# EasyEDA Pro project design.epro, board testing_stage1_pcb
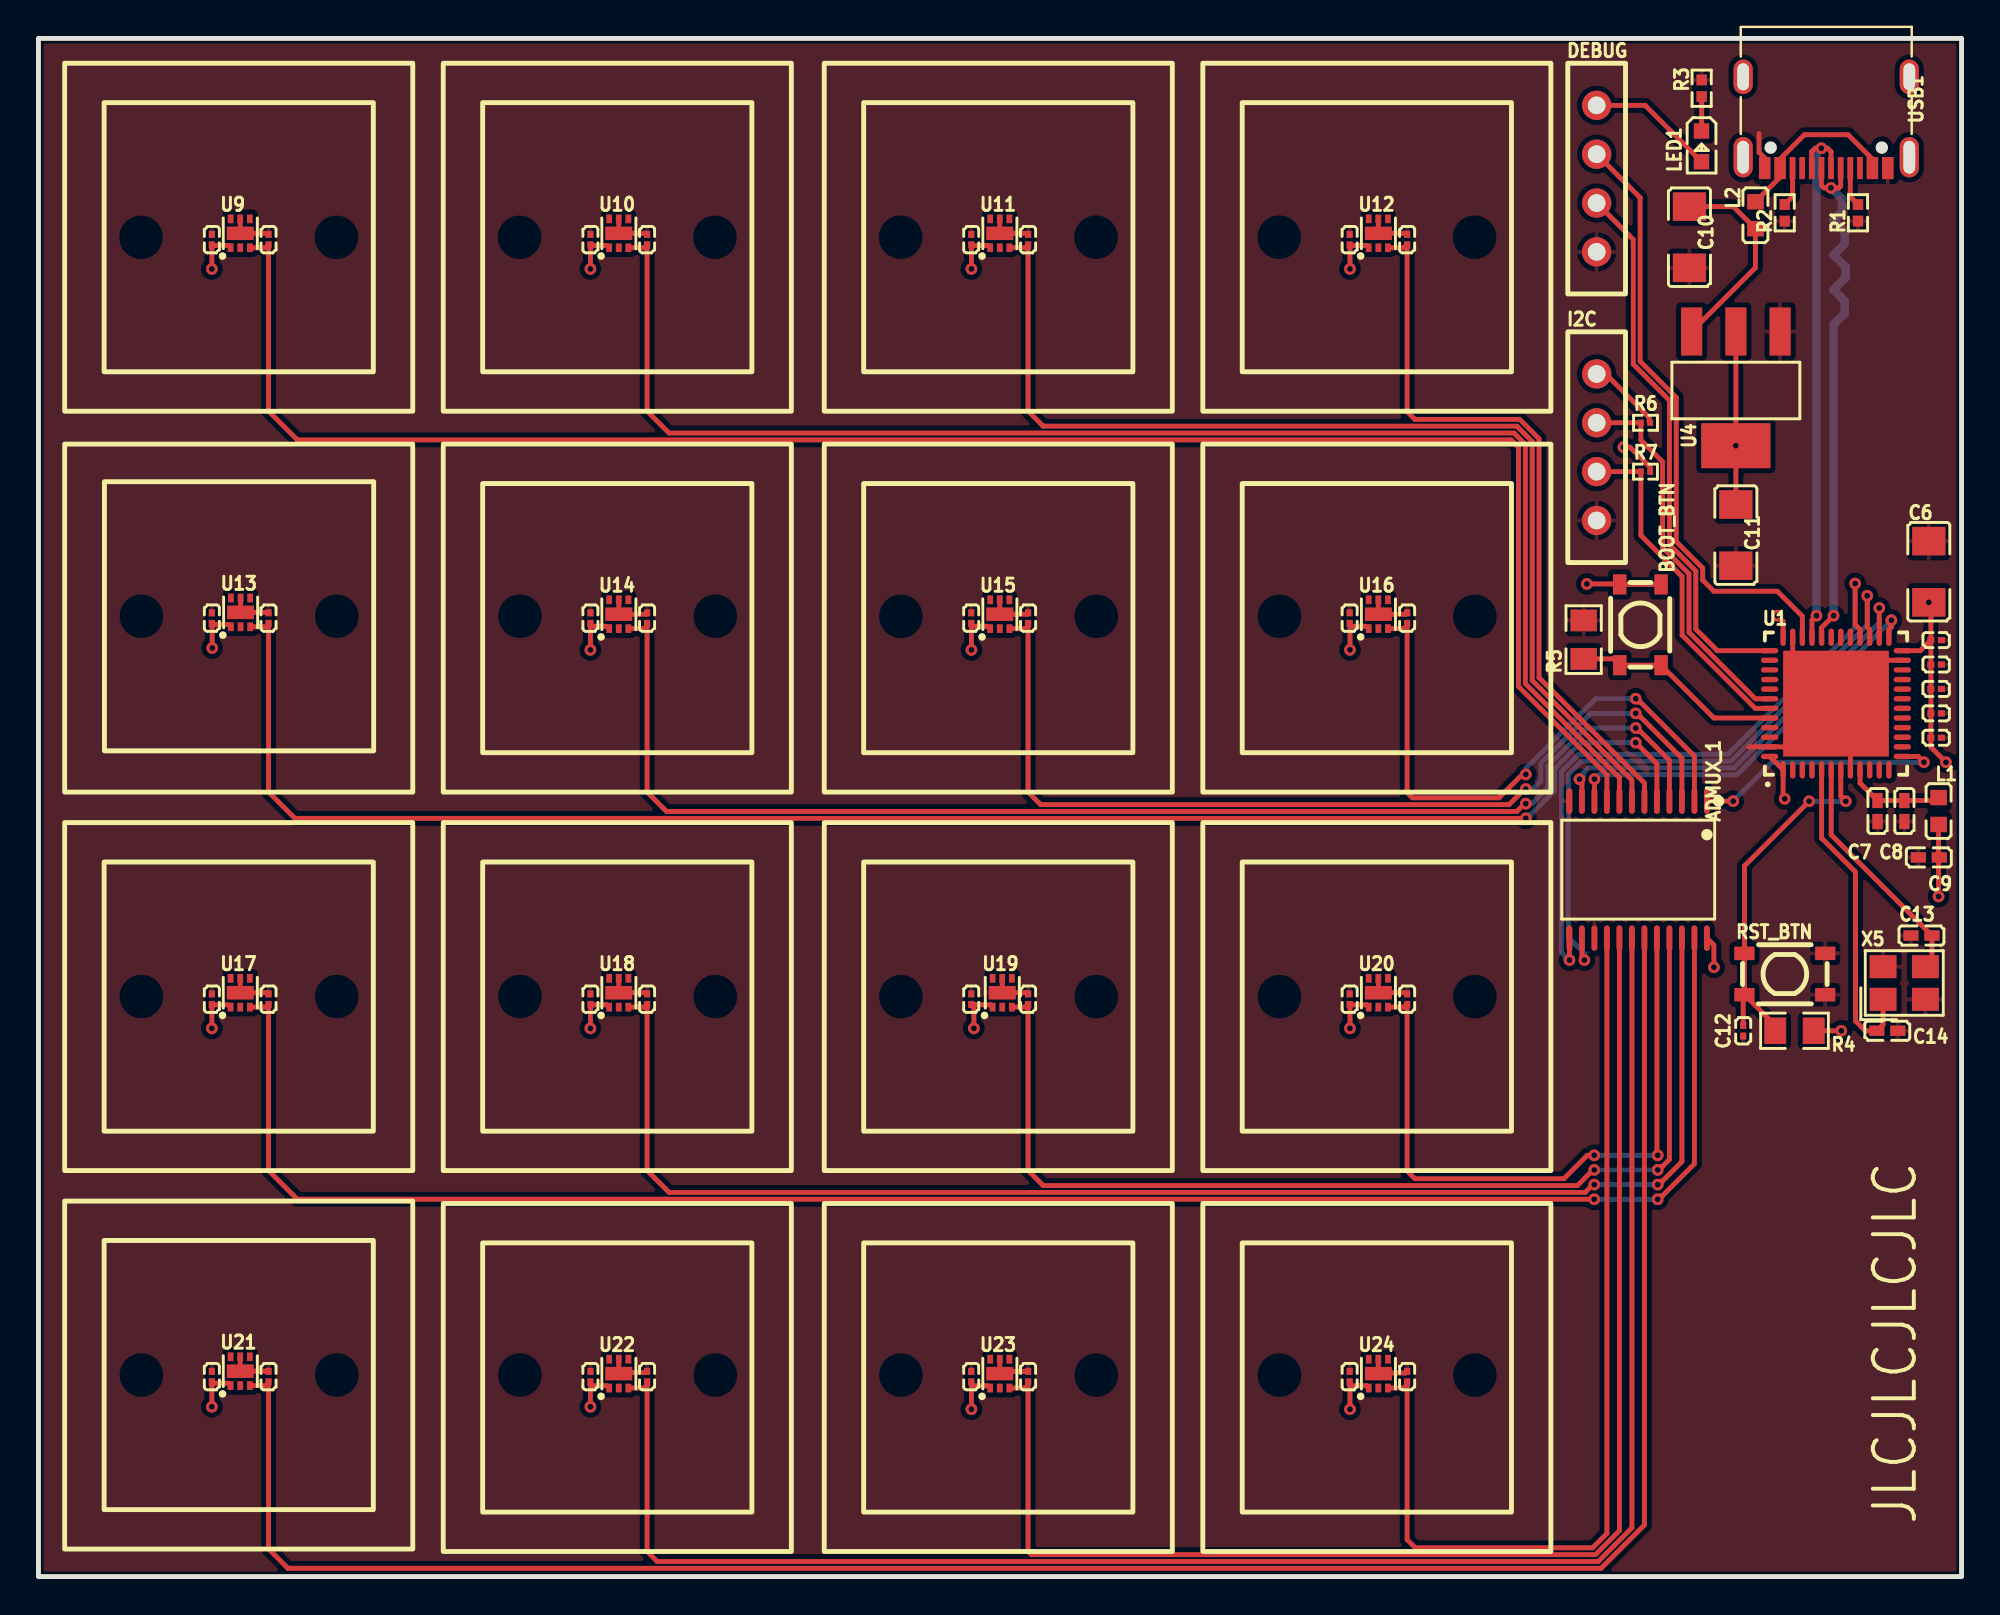
[diagram p15: board, top side]
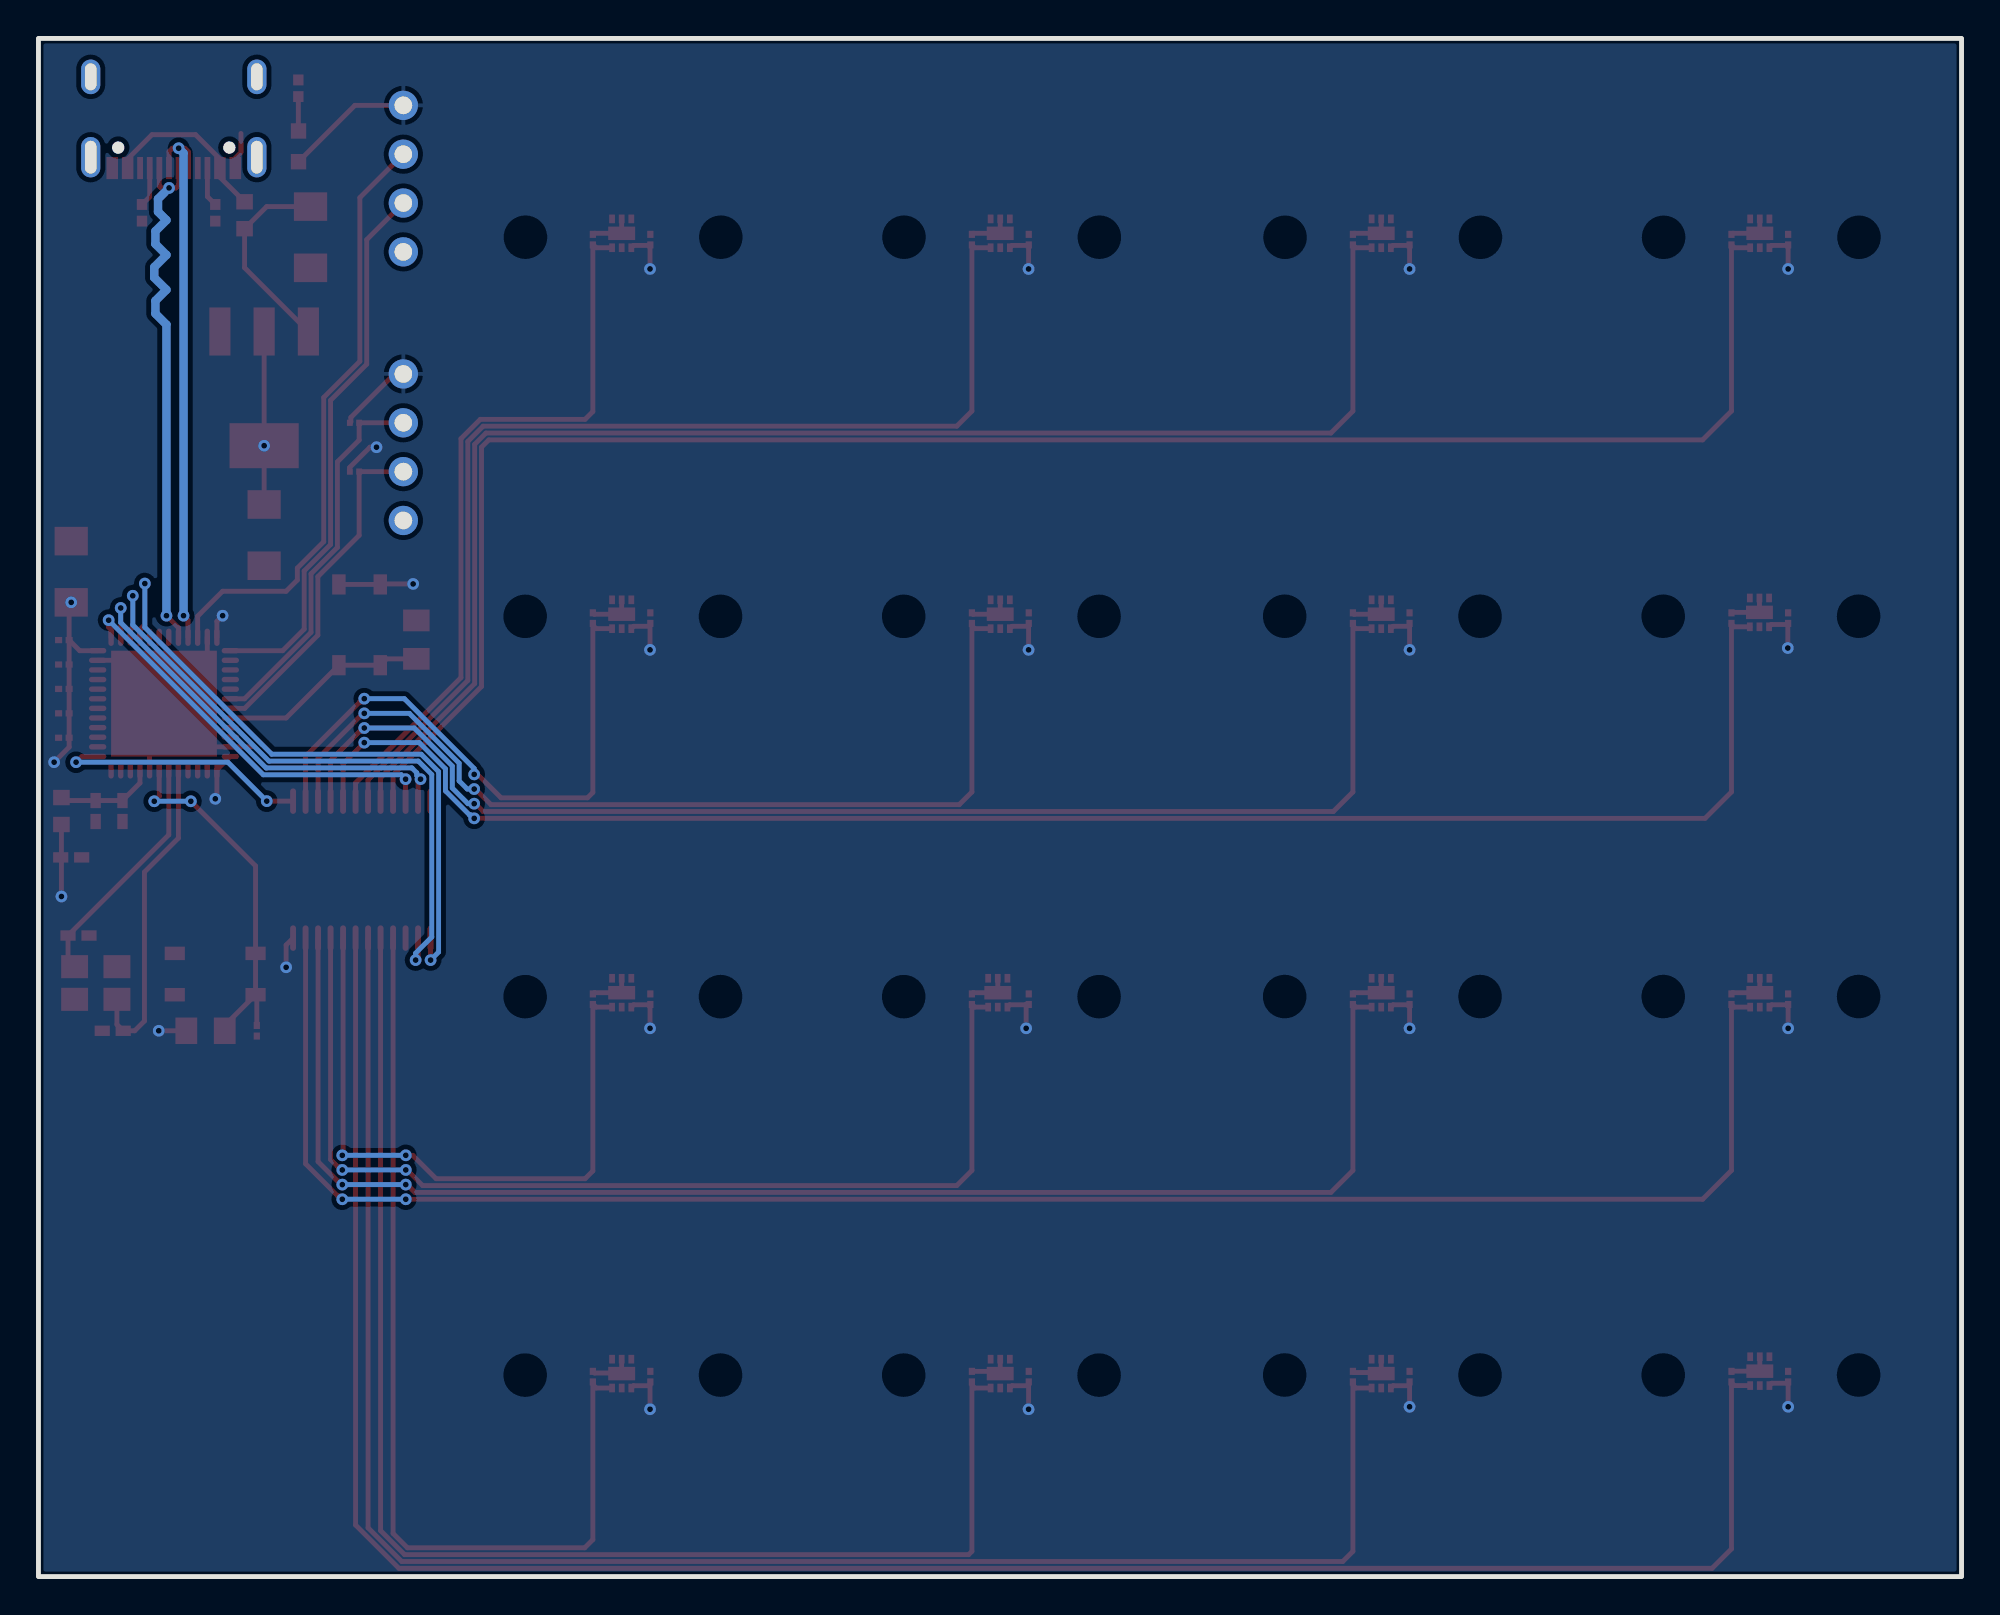
[diagram p16: board, bottom side, seen from below]

Outline 100 x 80 mm; copper layers: Top Layer, Bottom Layer. Coordinates in mm from the lower left corner of the outline.
Outline path: rectangle 0,80 100,0
Stack: Top Layer 0.035mm / Dielectric1 1.51mm FR4 er 4.5 / Bottom Layer 0.035mm

## Design rules (mm)
net USB_DN: USB_D
net USB_DP: USB_D
template: Custom Config
spacing copperThickness1oz (default): track to track 0.102, other pairs 0.152 to 0.3
spacing copperThickness2oz: track to track 0.203, other pairs 0.152 to 0.3
track width copperThickness1oz (default): min 0.127, default 0.254, max 2.54
track width copperThickness2oz: min 0.203, default 0.254, max 2.54
differential pair differentialPair (default): width min 0.438, default 0.438, max 2.54; gap min 0.203, default 0.203
via viaSize (default): diameter min 0.5, default 0.61, max 10; hole min 0.3, default 0.305, max 6.3

## Placement (name value [footprint] x y rotation side)
ADMUX_1  CD74HC4067SM96  [SSOP-24_L8.1-W5.3-P0.65-LS7.8-BL]  83.19 36.77 180 top
BOOT_BTN  SKRPACE010  [KEY-SMD_4P-L4.2-W3.2-P2.20-LS4.6]  83.3 49.5 270 top
C1  100nF  [C0201]  98.68 48.71 0 top
C2  100nF  [C0201]  98.68 47.44 0 top
C3  100nF  [C0201]  98.68 46.17 0 top
C4  100nF  [C0201]  98.68 44.9 0 top
C5  100nF  [C0201]  98.68 43.63 0 top
C6  10uF  [C1206]  98.3 52.26 270 top
C7  10nF  [C0402]  95.63 39.82 90 top
C8  1uF  [C0402]  97.03 39.82 90 top
C9  1uF  [C0402]  98.3 37.4 0 top
C10  22uF  [C1206]  85.85 69.66 90 top
C11  22uF  [C1206]  88.26 54.17 90 top
C12  100nF  [C0201]  88.65 28.39 270 top
C13  20pF  [C0402]  97.92 33.34 0 top
C14  20pF  [C0402]  96.14 28.39 180 top
C15  100nF  [C0201]  9.02 69.53 270 top
C16  100nF  [C0201]  11.96 69.53 270 top
C17  100nF  [C0201]  28.7 69.53 270 top
C18  100nF  [C0201]  31.65 69.53 270 top
C19  100nF  [C0201]  48.5 69.53 270 top
C20  100nF  [C0201]  51.46 69.53 270 top
C21  100nF  [C0201]  68.18 69.53 270 top
C22  100nF  [C0201]  71.17 69.53 270 top
C23  100nF  [C0201]  9.02 49.85 270 top
C24  100nF  [C0201]  11.96 49.85 270 top
C25  100nF  [C0201]  28.7 49.85 270 top
C26  100nF  [C0201]  31.65 49.85 270 top
C27  100nF  [C0201]  48.5 49.85 270 top
C28  100nF  [C0201]  51.46 49.85 270 top
C29  100nF  [C0201]  68.18 49.85 270 top
C30  100nF  [C0201]  71.17 49.85 270 top
C31  100nF  [C0201]  9.02 30.03 270 top
C32  100nF  [C0201]  11.96 30.03 270 top
C33  100nF  [C0201]  28.7 30.03 270 top
C34  100nF  [C0201]  31.65 30.03 270 top
C35  100nF  [C0201]  48.5 30.03 270 top
C36  100nF  [C0201]  51.46 30.03 270 top
C37  100nF  [C0201]  68.18 30.03 270 top
C38  100nF  [C0201]  71.17 30.03 270 top
C39  100nF  [C0201]  9.02 10.4 270 top
C40  100nF  [C0201]  11.96 10.4 270 top
C41  100nF  [C0201]  28.7 10.4 270 top
C42  100nF  [C0201]  31.65 10.4 270 top
C43  100nF  [C0201]  48.5 10.4 270 top
C44  100nF  [C0201]  51.46 10.4 270 top
C45  100nF  [C0201]  68.18 10.4 270 top
C46  100nF  [C0201]  71.17 10.4 270 top
DEBUG  -  [4 Pin Header]  81.03 72.71 0 top
I2C  -  [4 Pin Header]  81.03 58.74 0 top
L1  BLM18AG121SN1D  [L0603]  98.81 39.82 90 top
L2  BLM18AG121SN1D  [L0603]  89.28 70.81 270 top
LED1  KT-0603R  [LED0603-RD]  86.48 74.39 270 top
R1  5.1kΩ  [R0402]  94.62 70.93 90 top
R2  5.1kΩ  [R0402]  90.81 70.93 270 top
R3  5.1kΩ  [R0402]  86.49 77.41 270 top
R4  10kΩ  [R0805]  91.31 28.39 180 top
R5  10kΩ  [R0805]  80.35 48.73 90 top
R6  1.2kΩ  [R0201]  83.57 60.01 0 top
R7  1.2kΩ  [R0201]  83.57 57.47 0 top
RST_BTN  SKRPACE010  [KEY-SMD_4P-L4.2-W3.2-P2.20-LS4.6]  90.81 31.34 0 top
U1  STM32F411CEU6  [UFQFPN-48_L7.0-W7.0-P0.50-BL-EP]  93.47 45.41 0 top
U4  AMS1117-3.3  [SOT-223-3_L6.5-W3.4-P2.30-LS7.0-BR]  88.26 61.79 90 top
U9  HAL9303RSW  [DFN1616-6_L1.6-W1.6-P0.50-BL-EP_RICOH_RP500X]  10.49 69.86 0 top
U10  HAL9303RSW  [DFN1616-6_L1.6-W1.6-P0.50-BL-EP_RICOH_RP500X]  30.18 69.86 0 top
U11  HAL9303RSW  [DFN1616-6_L1.6-W1.6-P0.50-BL-EP_RICOH_RP500X]  49.99 69.86 0 top
U12  HAL9303RSW  [DFN1616-6_L1.6-W1.6-P0.50-BL-EP_RICOH_RP500X]  69.67 69.86 0 top
U13  HAL9303RSW  [DFN1616-6_L1.6-W1.6-P0.50-BL-EP_RICOH_RP500X]  10.51 50.15 0 top
U14  HAL9303RSW  [DFN1616-6_L1.6-W1.6-P0.50-BL-EP_RICOH_RP500X]  30.18 50.05 0 top
U15  HAL9303RSW  [DFN1616-6_L1.6-W1.6-P0.50-BL-EP_RICOH_RP500X]  49.99 50.05 0 top
U16  HAL9303RSW  [DFN1616-6_L1.6-W1.6-P0.50-BL-EP_RICOH_RP500X]  69.67 50.05 0 top
U17  HAL9303RSW  [DFN1616-6_L1.6-W1.6-P0.50-BL-EP_RICOH_RP500X]  10.49 30.37 0 top
U18  HAL9303RSW  [DFN1616-6_L1.6-W1.6-P0.50-BL-EP_RICOH_RP500X]  30.18 30.37 0 top
U19  HAL9303RSW  [DFN1616-6_L1.6-W1.6-P0.50-BL-EP_RICOH_RP500X]  50.12 30.37 0 top
U20  HAL9303RSW  [DFN1616-6_L1.6-W1.6-P0.50-BL-EP_RICOH_RP500X]  69.67 30.37 0 top
U21  HAL9303RSW  [DFN1616-6_L1.6-W1.6-P0.50-BL-EP_RICOH_RP500X]  10.49 10.68 0 top
U22  HAL9303RSW  [DFN1616-6_L1.6-W1.6-P0.50-BL-EP_RICOH_RP500X]  30.18 10.56 0 top
U23  HAL9303RSW  [DFN1616-6_L1.6-W1.6-P0.50-BL-EP_RICOH_RP500X]  49.99 10.56 0 top
U24  HAL9303RSW  [DFN1616-6_L1.6-W1.6-P0.50-BL-EP_RICOH_RP500X]  69.67 10.56 0 top
USB1  UC09-0O16F00P11  [USB-C-SMD_UC09-0O16F00P11]  92.96 75.63 180 top
X5  25MHz  [CRYSTAL-SMD_4P-L3.2-W2.5-BL]  97.02 30.87 0 top

## Footprints (pads in the part's own frame, mm; a bottom-side part is the same pattern mirrored in y, then rotated)
4 Pin Header
  round 1.524 hole 0.914: 1(0,3.81) 2(0,1.27) 3(0,-1.27) 4(0,-3.81)
C0201
  rect 0.368x0.324 smd: 1(-0.275,0) 2(0.275,0)
C0402
  rect 0.79x0.54 smd: 1(-0.545,0) 2(0.545,0)
C1206
  rect 1.485x1.728 smd: 1(-1.593,0) 2(1.593,0)
CRYSTAL-SMD_4P-L3.2-W2.5-BL
  rect 1.4x1.2 smd: 1(-1.1,-0.85) 2(1.1,-0.85) 3(1.1,0.85) 4(-1.1,0.85)
DFN1616-6_L1.6-W1.6-P0.50-BL-EP_RICOH_RP500X
  rect 0.3x0.45 smd: 1(-0.5,-0.75) 2(0,-0.75) 3(0.5,-0.75) 4(0.5,0.75) 5(0,0.75) 6(-0.5,0.75)
  rect 1.4x0.7 smd: 7(0,0)
KEY-SMD_4P-L4.2-W3.2-P2.20-LS4.6
  rect 1.05x0.7 smd: 1(-2.1,1.075) 2(2.1,1.075) 3(-2.1,-1.075) 4(2.1,-1.075)
L0603
  rect 0.8x0.864 smd: 1(-0.7,0) 2(0.7,0)
LED0603-RD
  rect 0.8x0.8 smd: 1(-0.799,0) 2(0.799,0)
R0201
  rect 0.303x0.324 smd: 1(-0.241,0) 2(0.241,0)
R0402
  rect 0.566x0.54 smd: 1(-0.433,0) 2(0.433,0)
R0805
  rect 1.133x1.377 smd: 1(-1,0) 2(1,0)
SOT-223-3_L6.5-W3.4-P2.30-LS7.0-BR
  rect 2.5x1.1 smd: 1(2.97,-2.3) 2(2.97,0) 3(2.97,2.3)
  rect 2.34x3.6 smd: 4(-2.97,0)
SSOP-24_L8.1-W5.3-P0.65-LS7.8-BL
  oval 0.308x1.324 smd: 1(-3.575,-3.562) 2(-2.925,-3.562) 3(-2.275,-3.562) 4(-1.625,-3.562) 5(-0.975,-3.562) 6(-0.325,-3.562) 7(0.325,-3.562) 8(0.975,-3.562) 9(1.625,-3.562) 10(2.275,-3.562) 11(2.925,-3.562) 12(3.575,-3.562) 13(3.575,3.562) 14(2.925,3.562) 15(2.275,3.562) 16(1.625,3.562) 17(0.975,3.562) 18(0.325,3.562) 19(-0.325,3.562) 20(-0.975,3.562) 21(-1.625,3.562) 22(-2.275,3.562) 23(-2.925,3.562) 24(-3.575,3.562)
UFQFPN-48_L7.0-W7.0-P0.50-BL-EP
  oval 0.28x0.9 smd: 1(-2.751,-3.45) 2(-2.251,-3.45) 3(-1.75,-3.45) 4(-1.25,-3.45) 5(-0.749,-3.45) 6(-0.249,-3.45) 7(0.249,-3.45) 8(0.75,-3.45) 9(1.25,-3.45) 10(1.75,-3.45) 11(2.251,-3.45) 12(2.751,-3.45) 25(2.751,3.449) 26(2.251,3.449) 27(1.75,3.449) 28(1.25,3.449) 29(0.75,3.449) 30(0.249,3.449) 31(-0.249,3.449) 32(-0.749,3.449) 33(-1.25,3.449) 34(-1.75,3.449) 35(-2.251,3.449) 36(-2.751,3.449)
  oval 0.9x0.28 smd: 13(3.45,-2.751) 14(3.45,-2.251) 15(3.45,-1.75) 16(3.45,-1.25) 17(3.45,-0.75) 18(3.45,-0.249) 19(3.45,0.249) 20(3.45,0.749) 21(3.45,1.25) 22(3.45,1.75) 23(3.45,2.251) 24(3.45,2.751) 37(-3.449,2.751) 38(-3.449,2.251) 39(-3.449,1.75) 40(-3.449,1.25) 41(-3.449,0.749) 42(-3.449,0.249) 43(-3.449,-0.249) 44(-3.449,-0.75) 45(-3.449,-1.25) 46(-3.449,-1.75) 47(-3.449,-2.251) 48(-3.449,-2.751)
  rect 5.5x5.5 smd: 49(0,0)
USB-C-SMD_UC09-0O16F00P11
  oval 1x2.1 hole 0.6x1.7: 1(-4.32,1.808) 4(4.32,1.808)
  oval 1x1.8 hole 0.6x1.4: 2(-4.32,-2.373) 3(4.32,-2.373)
  rect 0.6x1.15 smd: A1-B12(-3.2,2.373) A4-B9(-2.4,2.373) B1-A12(3.2,2.373) B4-A9(2.4,2.373)
  rect 0.3x1.15 smd: A5(-1.25,2.373) A6(-0.25,2.373) A7(0.25,2.373) A8(1.25,2.373) B5(1.75,2.373) B6(0.75,2.373) B7(-0.75,2.373) B8(-1.75,2.373)

## Nets
As in the schematic.

Pads without a net: U1 2 3 4 10 11 12 14 15 16 17 18 19 20 21 22 29 30 31 38 39 40 41 45 46; U9 2 4 6; U10 2 4 6; U11 2 4 6; U12 2 4 6; U13 2 4 6; U14 2 4 6; U15 2 4 6; U16 2 4 6; U17 2 4 6; U18 2 4 6; U19 2 4 6; U20 2 4 6; U21 2 4 6; U22 2 4 6; U23 2 4 6; U24 2 4 6; USB1 1 2 3 4 A8 B8

## Via types
v1: diameter 0.61, hole 0.305, Top Layer to Bottom Layer, 58 vias

## Routing (per net, layer and track width the routed paths; a pad name or vN(x,y) marks a point on that pad's centre or on a via; arc(x,y) is an arc through that point)
+3.3V: length 83
  Top Layer w0.254: v1(93.75,28.39) R4.1 ; U23.1 49.37,9.93 48.54,9.93 48.51,9.95 v1(48.51,8.7) ; C1.1 98.4,50.56 v1(98.3,50.67) ; C1.1 97.85,48.16 U1.24 ; C1.1 C2.1 C3.1 C4.1 C5.1 98.4,43.14 v1(99.19,42.36) ; U4.2 v1(88.26,58.82) C11.2 ; U17.1 9.87,29.74 9.04,29.74 9.02,29.76 v1(9.02,28.51) ; v1(90.42,49.98) 90.72,49.68 U1.36 ; U13.1 9.89,49.52 9.06,49.52 9.03,49.54 v1(9.03,48.3) ; DEBUG.1 83.55,76.52 LED1.2 ; L1.1 98.81,37.44 C9.2 98.81,37.37 v1(98.81,35.37) ; v1(28.7,8.83) 28.7,9.93 29.56,9.93 U22.1 ; U1.48 U1.1 90.72,40.54 v1(90.81,40.45) ; v1(28.7,28.51) 28.7,29.76 28.73,29.74 29.56,29.74 U18.1 ; U9.1 9.87,69.24 9.04,69.24 C15.2 v1(9.02,68.01) ; v1(80.52,51.63) 82.2,51.63 BOOT_BTN.3 BOOT_BTN.1 ; R6.2 83.75,60.06 83.75,60.29 81.49,62.55 I2C.1 ; v1(28.7,48.2) 28.7,49.45 28.73,49.42 29.56,49.42 U14.1 ; v1(9.02,8.83) 9.02,10.08 9.04,10.05 9.87,10.05 U21.1 ; v1(68.2,8.7) 68.2,9.95 68.22,9.93 69.05,9.93 U24.1 ; U15.1 49.37,49.42 48.54,49.42 48.51,49.45 v1(48.51,48.2) ; v1(28.7,68.01) C17.2 28.73,69.24 29.56,69.24 U10.1 ; v1(87.12,31.69) 87.12,32.84 ADMUX_1.24 ; U11.1 49.37,69.24 48.54,69.24 48.51,69.26 v1(48.51,68.01) ; U19.1 49.49,29.74 48.67,29.74 48.64,29.76 v1(48.64,28.51) ; v1(82.42,58.74) 82.76,58.74 83.82,57.68 83.82,57.48 R7.2 ; U12.1 69.05,69.24 68.22,69.24 68.2,69.26 v1(68.2,68.01) ; v1(68.2,48.2) 68.2,49.45 68.22,49.42 69.05,49.42 U16.1 ; U20.1 69.05,29.74 68.22,29.74 68.2,29.76 v1(68.2,28.51)
+3.3VA: length 5.2
  Top Layer w0.254: U1.9 94.72,41.27 C7.2 C8.2 98.65,40.36 L1.2
+5V: length 10.6
  Top Layer w0.254: C10.2 88.13,71.25 L2.2 89.28,68.08 U4.3
GND: length 55.9
  Top Layer w0.254: U15.5 U15.7 51.41,50.05 51.46,50.11 C28.1 ; U1.23 95.72,47.66 U1.49 ; 11.98,50.09 11.93,50.15 U13.7 U13.5 ; C26.1 31.65,50.11 31.59,50.05 U14.7 U14.5 ; U1.35 91.22,47.66 U1.49 ; U17.5 U17.7 11.91,30.37 11.96,30.31 ; 11.96,10.63 11.91,10.68 U21.7 U21.5 ; U9.5 U9.7 11.91,69.86 C16.1 ; U24.5 U24.7 69.7,10.59 71.09,10.59 C46.1 ; U23.5 U23.7 50.1,10.67 C44.1 ; U11.5 U11.7 51.41,69.86 C20.1 ; U20.5 U20.7 71.09,30.37 71.15,30.31 ; USB1.B1-A12 89.76,73.78 89.47,74.07 89.47,75.06 ; U1.8 94.22,44.66 U1.49 ; 31.65,30.31 31.59,30.37 U18.7 U18.5 ; C36.1 51.4,30.37 U19.7 U19.5 ; U12.5 U12.7 71.09,69.86 71.15,69.81 ; U1.49 91.22,43.15 U1.47 88.94,43.15 ; C18.1 31.59,69.86 U10.7 U10.5 ; C42.1 31.59,10.61 30.23,10.61 U22.7 U22.5 ; U16.5 U16.7 71.1,50.05 C30.1
VBUS: length 9.1
  Top Layer w0.254: 89.28,71.5 90.56,72.79 USB1.B4-A9 90.56,73.73 91.83,75 94.1,75 95.36,73.73 USB1.A4-B9
AMUX_0: length 95.8
  Top Layer w0.254: ADMUX_1.9 81.56,41.7 76.96,46.29 76.96,58.74 76.58,59.12 13.46,59.12 11.96,60.62 C16.2 11.82,69.11 U9.3
AMUX_1: length 76.6
  Top Layer w0.254: ADMUX_1.8 82.21,41.55 77.32,46.44 77.32,58.89 76.73,59.48 32.79,59.48 31.65,60.62 C18.2 31.5,69.11 U10.3
AMUX_2: length 57.4
  Top Layer w0.254: ADMUX_1.7 82.86,41.42 77.67,46.61 77.67,59.03 76.88,59.83 52.25,59.83 51.46,60.62 C20.2 51.31,69.11 U11.3
AMUX_3: length 38.3
  Top Layer w0.254: C22.2 71.17,60.59 71.58,60.19 77.02,60.19 78.03,59.18 78.03,46.75 83.51,41.27 ADMUX_1.6 ; 71.15,69.26 71,69.11 U12.3
AMUX_4: length 87.3
  Top Layer w0.254: 11.96,49.53 11.83,49.4 U13.3 ; 11.96,49.53 C24.2 ; 11.96,49.53 11.96,40.81 13.33,39.44 v1(77.34,39.44) ; 11.96,49.53 11.98,49.54 ; ADMUX_1.5 84.16,42.27 v1(83.06,43.37)
  Bottom Layer w0.254: v1(83.06,43.37) 80.2,43.37 78.84,42.01 78.84,40.87 77.59,39.61 77.52,39.61 v1(77.34,39.44)
AMUX_5: length 68.7
  Top Layer w0.254: 31.65,49.45 31.5,49.3 U14.3 ; C26.2 31.65,40.81 32.66,39.79 76.87,39.79 77.28,40.2 v1(77.34,40.2) ; ADMUX_1.4 84.81,42.45 83.3,43.96 83.24,43.96 v1(83.06,44.14)
  Bottom Layer w0.254: v1(77.34,40.2) 77.67,40.2 78.48,41.01 78.48,42.16 80.46,44.14 v1(83.06,44.14)
AMUX_6: length 49.8
  Top Layer w0.254: 51.46,49.45 51.31,49.3 U15.3 ; 51.46,49.45 51.46,40.81 52.12,40.15 76.47,40.15 77.28,40.96 v1(77.34,40.96) ; 51.46,49.45 C28.2 ; v1(83.06,44.9) 83.24,44.72 83.3,44.72 85.46,42.56 ADMUX_1.3
  Bottom Layer w0.254: v1(83.06,44.9) 80.72,44.9 78.12,42.31 78.12,41.38 77.7,40.96 v1(77.34,40.96)
AMUX_7: length 30.8
  Top Layer w0.254: 71.15,49.45 71,49.3 U16.3 ; v1(83.06,45.66) 83.24,45.48 83.3,45.48 86.11,42.67 ADMUX_1.2 ; C30.2 71.17,40.78 71.45,40.5 75.95,40.5 77.16,41.72 v1(77.34,41.72)
  Bottom Layer w0.254: v1(77.34,41.72) 77.34,42.03 80.97,45.66 v1(83.06,45.66)
AMUX_8: length 96.9
  Top Layer w0.254: 11.96,29.76 11.82,29.62 U17.3 ; ADMUX_1.23 86.11,21.47 84.44,19.8 84.38,19.8 v1(84.2,19.62) ; C32.2 11.96,21.12 13.46,19.62 v1(80.9,19.62)
  Bottom Layer w0.254: v1(80.9,19.62) v1(84.2,19.62)
AMUX_9: length 76.2
  Top Layer w0.254: v1(80.9,20.39) 80.84,20.39 80.43,19.98 32.79,19.98 31.65,21.12 C34.2 ; U18.3 31.5,29.62 31.65,29.76 ; ADMUX_1.22 85.46,21.58 84.44,20.56 84.38,20.56 v1(84.2,20.39)
  Bottom Layer w0.254: v1(84.2,20.39) v1(80.9,20.39)
AMUX_10: length 55.2
  Top Layer w0.254: ADMUX_1.21 84.81,21.69 84.44,21.33 84.38,21.33 v1(84.2,21.15) ; U19.3 51.31,29.62 51.33,29.64 51.46,29.64 ; v1(80.9,21.15) 80.84,21.15 80.02,20.34 52.25,20.34 51.46,21.12 51.46,29.64 ; 51.46,29.64 51.46,29.76
  Bottom Layer w0.254: v1(80.9,21.15) v1(84.2,21.15)
AMUX_11: length 34.7
  Top Layer w0.254: U20.3 71,29.62 71.15,29.76 ; v1(80.9,21.91) 80.54,21.91 79.32,20.69 71.58,20.69 71.17,21.1 C38.2 ; v1(84.2,21.91) 84.16,21.95 ADMUX_1.20
  Bottom Layer w0.254: v1(84.2,21.91) v1(80.9,21.91)
AMUX_12: length 113.1
  Top Layer w0.254: U21.3 11.82,9.93 11.96,10.08 ; 11.96,10.08 C40.2 ; 11.96,10.08 11.96,1.44 12.97,0.43 81.26,0.43 83.51,2.68 ADMUX_1.19
AMUX_13: length 92.7
  Top Layer w0.254: U22.3 31.5,9.81 31.65,9.95 ; C42.2 31.65,1.31 32.18,0.78 81.11,0.78 82.86,2.53 ADMUX_1.18
AMUX_14: length 72
  Top Layer w0.254: ADMUX_1.17 82.21,2.39 80.96,1.14 51.63,1.14 51.46,1.31 C44.2 ; U23.3 51.31,9.81 51.46,9.95
AMUX_15: length 51.1
  Top Layer w0.254: 71.15,9.95 71,9.81 U24.3 ; C46.2 71.17,1.92 71.6,1.5 80.81,1.5 81.56,2.24 ADMUX_1.16
AMUX_COM: length 13.4
  Top Layer w0.254: ADMUX_1.1 v1(88.13,40.33) ; U1.13 97.75,42.65 v1(98.04,42.36)
  Bottom Layer w0.254: v1(98.04,42.36) 90.15,42.36 v1(88.13,40.33)
BOOT0: length 10.9
  Top Layer w0.254: R5.1 81.9,47.73 82.23,47.4 84.38,47.4 87.12,44.66 U1.44
HSE_IN: length 16.9
  Top Layer w0.254: U1.5 92.72,38.41 94.49,36.64 94.49,28.89 95,28.39 C14.2 95.92,28.71 X5.1
HSE_OUT: length 12.5
  Top Layer w0.254: U1.6 93.22,38.58 C13.2 98.46,32.06 X5.3
NRST: length 19.3
  Top Layer w0.254: R4.2 90.31,28.66 RST_BTN.3 ; RST_BTN.3 88.65,30.2 C12.1 ; RST_BTN.3 RST_BTN.1 88.71,36.96 v1(92.07,40.33) ; U1.7 93.72,40.58 v1(93.98,40.33)
  Bottom Layer w0.254: v1(93.98,40.33) v1(92.07,40.33)
SCL: length 19.9
  Top Layer w0.254: U1.42 89.28,45.65 85.83,49.11 85.83,52.16 84.46,53.53 84.46,57.98 83.32,59.11 R6.1 I2C.2
SDA: length 17.8
  Top Layer w0.254: U1.43 89.28,45.16 85.47,48.96 85.47,52.01 83.32,54.16 R7.1 I2C.3
SEL0: length 20.9
  Top Layer w0.254: U1.25 96.22,49.26 96.35,49.38 v1(96.35,49.74) ; v1(80.91,41.47) ADMUX_1.10
  Bottom Layer w0.254: v1(80.91,41.47) 81.14,41.7 88.31,41.7 v1(96.35,49.74)
SEL1: length 22.5
  Top Layer w0.254: v1(80.13,41.47) 80.26,41.35 ADMUX_1.11 ; U1.26 v1(95.72,50.38)
  Bottom Layer w0.254: v1(80.13,41.47) 80.33,41.67 80.33,41.8 80.58,42.06 88.16,42.06 95.72,49.62 v1(95.72,50.38)
SEL2: length 33.7
  Top Layer w0.254: ADMUX_1.14 80.26,32.19 v1(80.39,32.06) ; U1.27 95.22,49.26 95.09,49.38 v1(95.09,51.01)
  Bottom Layer w0.254: v1(95.09,51.01) 95.09,49.5 88.01,42.41 80.25,42.41 79.55,41.72 79.55,33.26 80.39,32.42 v1(80.39,32.06)
SEL3: length 34.7
  Top Layer w0.254: ADMUX_1.13 v1(79.61,32.06) ; v1(94.47,51.65) 94.47,49.51 94.72,49.26 U1.28
  Bottom Layer w0.254: v1(79.61,32.06) 79.19,32.48 79.19,41.86 80.1,42.77 87.87,42.77 94.47,49.37 v1(94.47,51.65)
SWCLK: length 28.6
  Top Layer w0.254: DEBUG.3 82.93,69.53 82.93,63.06 84.81,61.18 84.81,53.68 86.18,52.3 86.18,49.27 87.3,48.16 U1.37
SWDIO: length 31.5
  Top Layer w0.254: DEBUG.2 83.29,71.72 83.29,63.21 85.17,61.33 85.17,53.82 86.54,52.45 86.54,51.83 87.12,51.25 90.42,51.25 91.72,49.95 U1.34
USB_DN: length 28.6
  Top Layer w0.254: 92.71,48.77 92.71,49.34 v1(93.34,49.98) ; USB1.A7 92.71,73.25 92.71,72.37 92.85,72.23 v1(93.21,72.23) 93.62,72.23 93.71,72.32 USB1.B7
  Bottom Layer w0.438: v1(93.34,49.98) 93.34,65.12 93.92,65.69 93.92,66.35 93.34,66.93 93.98,67.56 93.98,68.1 93.34,68.74 93.92,69.31 93.92,69.98 93.34,70.55 93.78,70.99 93.78,71.65 v1(93.21,72.23)
USB_DP: length 28.5
  Top Layer w0.254: USB1.B6 92.2,73.27 92.2,74.11 92.39,74.29 v1(92.71,74.29) 93.03,74.29 93.21,74.11 USB1.A6 ; U1.33 92.22,49.74 v1(92.46,49.98)
  Bottom Layer w0.438: v1(92.71,74.29) 92.46,74.04 v1(92.46,49.98)
$1N3487: length 2.1
  Top Layer w0.254: USB1.A5 94.21,71.77 94.62,71.36
$1N3526: length 2.1
  Top Layer w0.254: USB1.B5 91.21,71.77 90.81,71.36
$1N4144: length 1.8
  Top Layer w0.254: LED1.1 86.49,75.2 R3.2

## Copper pours and planes (outline as drawn; the poured copper is in the pictures)
+3.3V on Bottom Layer: 0,80 100,80 100,0 0,0
GND on Top Layer: 0,80 100,80 100,0 0,0

## Text on the board
Top Silkscreen Layer: JLCJLCJLCJLC
